# Altium schematic sheet MCU Power Clock Debug.SchDoc
size A4; Organization: TESLA Motors, INC; Address1: 3500 Deer Creek Road; Address2: Palo Alto, CA; Address4: U.S.A.; SheetNumber: 3; SheetTotal: 21
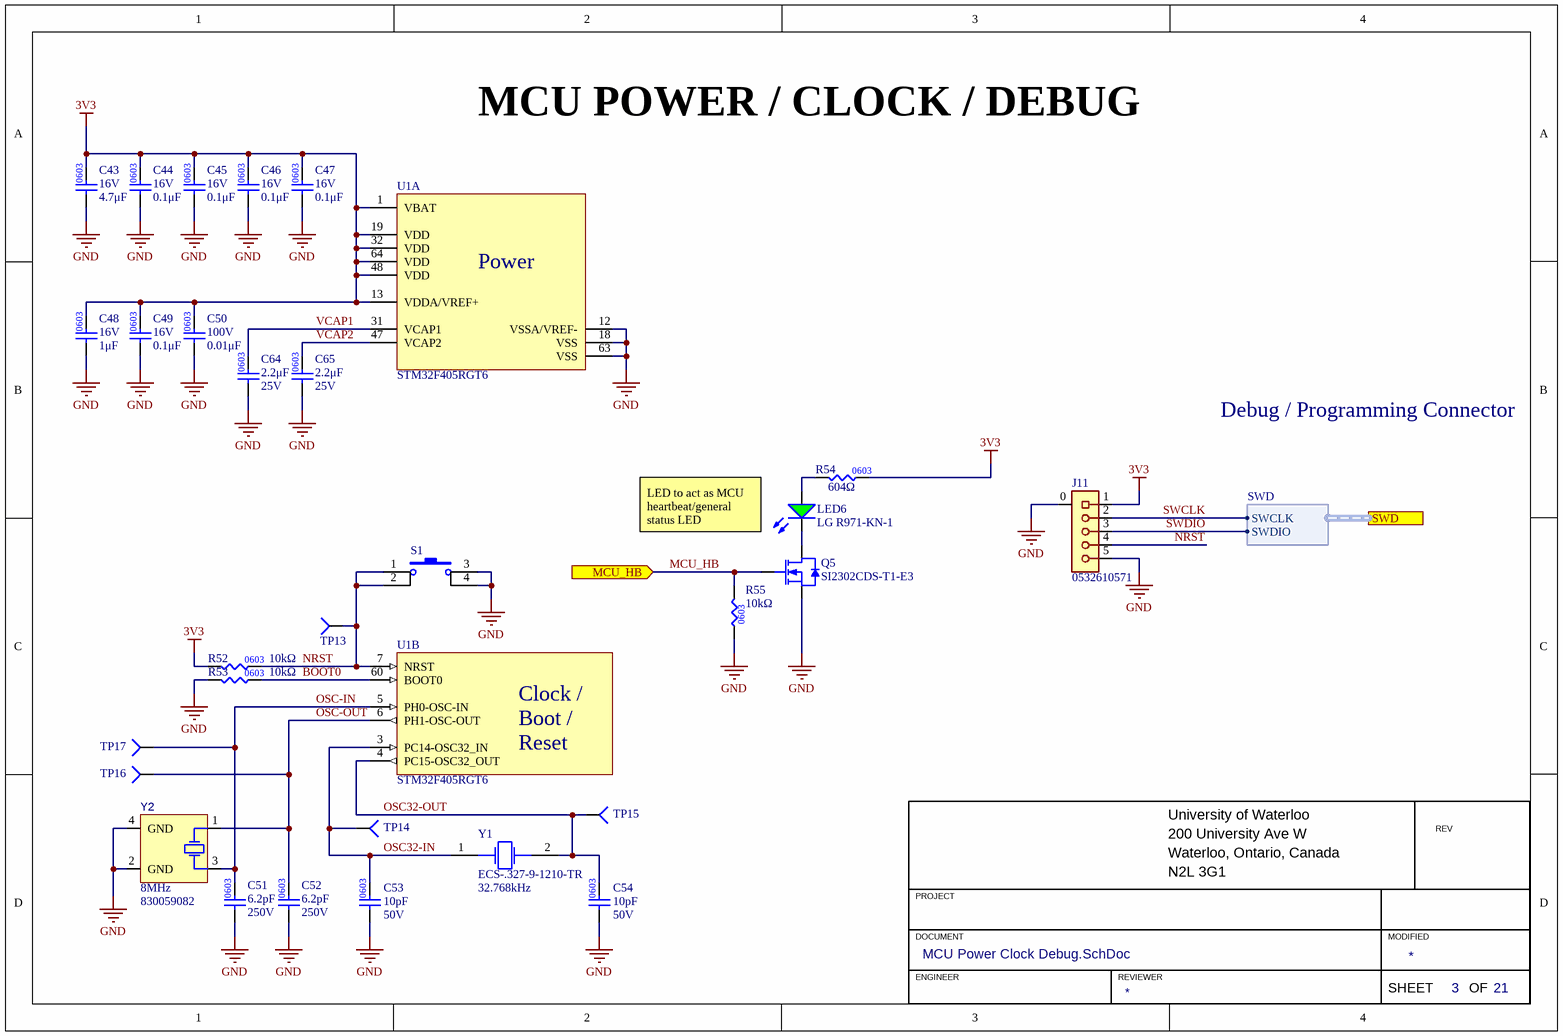
[diagram p0: MCU Power Clock Debug.SchDoc]

## Parts
C43  value 4.7μF  Voltage Rating: 16V  [CAP0603]  (hidden comment: CAP_4.7uF_16V_0603)
C44  value 0.1μF  Voltage Rating: 16V  [CAP0603]  (hidden comment: CAP_0.1uF_16V_0603)
C45  value 0.1μF  Voltage Rating: 16V  [CAP0603]  (hidden comment: CAP_0.1uF_16V_0603)
C46  value 0.1μF  Voltage Rating: 16V  [CAP0603]  (hidden comment: CAP_0.1uF_16V_0603)
C47  value 0.1μF  Voltage Rating: 16V  [CAP0603]  (hidden comment: CAP_0.1uF_16V_0603)
C48  value 1μF  Voltage Rating: 16V  [CAP0603]  (hidden comment: CAP_1uF_16V_0603)
C49  value 0.1μF  Voltage Rating: 16V  [CAP0603]  (hidden comment: CAP_0.1uF_16V_0603)
C50  value 0.01μF  Voltage Rating: 100V  [CAP0603]  (hidden comment: CAP_0.01uF_100V_0603)
C51  value 6.2pF  Voltage Rating: 250V  [CAP0603]  (hidden comment: CAP_6.2pF_250V_0603)
C52  value 6.2pF  Voltage Rating: 250V  [CAP0603]  (hidden comment: CAP_6.2pF_250V_0603)
C53  value 10pF  Voltage Rating: 50V  [CAP0603]  (hidden comment: CAP_10pF_50V_0603)
C54  value 10pF  Voltage Rating: 50V  [CAP0603]  (hidden comment: CAP_10pF_50V_0603)
C64  value 2.2μF  Voltage Rating: 25V  [CAP0603]  (hidden comment: CAP_2.2uF_25V_0603)
C65  value 2.2μF  Voltage Rating: 25V  [CAP0603]  (hidden comment: CAP_2.2uF_25V_0603)
J11  Manufacturer Part Number 1: 0532610571  [MOLEX-532610571]  (hidden comment: CON_MOLEX-PICO_5POS_RA)
LED6  Manufacturer Part Number 1: LG R971-KN-1  [LED_0805_GREEN]  (hidden comment: LED_GREEN)
Q5  Manufacturer Part Number 1: SI2302CDS-T1-E3  [SOT23-3]  (hidden comment: NMOS_20V_6A)
R52  value 10kΩ  [RES0603]  (hidden comment: RES_10kΩ_0603_1%)
R53  value 10kΩ  [RES0603]  (hidden comment: RES_10kΩ_0603_1%)
R54  value 604Ω  [RES0603]  (hidden comment: RES_604Ω_0603_1%)
R55  value 10kΩ  [RES0603]  (hidden comment: RES_10kΩ_0603_1%)
S1  SW_SPST_NO_4.5x4.5  [SPST_PUSHBUTTON_TL3305AF260QG]  (value not drawn)
TP13  TESTPOINT_1MM_CIRCLE  [TESTPOINT_CIRCLE_1MM]  (value not drawn)  (no BOM)
TP14  TESTPOINT_1MM_CIRCLE  [TESTPOINT_CIRCLE_1MM]  (value not drawn)  (no BOM)
TP15  TESTPOINT_1MM_CIRCLE  [TESTPOINT_CIRCLE_1MM]  (value not drawn)  (no BOM)
TP16  TESTPOINT_1MM_CIRCLE  [TESTPOINT_CIRCLE_1MM]  (value not drawn)  (no BOM)
TP17  TESTPOINT_1MM_CIRCLE  [TESTPOINT_CIRCLE_1MM]  (value not drawn)  (no BOM)
U1  STM32F405RGT6  [STM_LQFP64]  (parts A,B of 5)
Y1  Frequency: 32.768kHz  Manufacturer Part Number 1: ECS-.327-9-1210-TR  [OSC_ECS-327TR-2]  (hidden comment: CRYSTAL_32.768KHZ)
Y2  Frequency: 8MHz  Manufacturer Part Number 1: 830059082  [XTAL_WURTH_830059082]  (hidden comment: CRYSTAL_8MHZ_8PF)

## Ports
MCU_HB (in), SWD (harness SWD)

## Harnesses
SWD: SWDIO, SWCLK

## Nets
3V3: C43.2 C44.2 C45.2 C46.2 C47.2 C48.2 C49.2 C50.2 J11.1 R52.1 R54.2 U1.1(VBAT) U1.13(VDDA/VREF+) U1.19(VDD) U1.32(VDD) U1.48(VDD) U1.64(VDD)
GND: C43.1 C44.1 C45.1 C46.1 C47.1 C48.1 C49.1 C50.1 C51.1 C52.1 C53.1 C54.1 C64.1 C65.1 J11.0 J11.5 Q5.2(SOURCE) R53.1 R55.1 S1.3 S1.4 U1.12(VSSA/VREF-) U1.18(VSS) U1.63(VSS) Y2.2(GND) Y2.4(GND)
BOOT0: R53.2 U1.60(BOOT0)
MCU_HB: Q5.1(GATE) R55.2 ; port MCU_HB
NRST: J11.4 R52.2 S1.1 S1.2 TP13.1(=value) U1.7(NRST)
OSC32-IN: C53.2 TP14.1(=value) U1.3(PC14-OSC32_IN) Y1.1
OSC32-OUT: C54.2 TP15.1(=value) U1.4(PC15-OSC32_OUT) Y1.2
OSC-IN: C51.2 TP17.1(=value) U1.5(PH0-OSC-IN) Y2.3(HOT)
OSC-OUT: C52.2 TP16.1(=value) U1.6(PH1-OSC-OUT) Y2.1(HOT)
SWCLK: J11.2 ; port SWD.SWCLK
SWDIO: J11.3 ; port SWD.SWDIO
VCAP1: C64.2 U1.31(VCAP1)
VCAP2: C65.2 U1.47(VCAP2)
NetLED6_1: LED6.1(A) R54.1
NetLED6_2: LED6.2(K) Q5.3(DRAIN)

## Notes on the sheet
- MCU POWER / CLOCK / DEBUG
- Debug / Programming Connector
- LED to act as MCU heartbeat/general status LED
- University of Waterloo
- 200 University Ave W
- REV
- PROJECT
- Waterloo, Ontario, Canada
- N2L 3G1
- DOCUMENT
- ENGINEER
- REVIEWER
- MODIFIED
- SHEET
- OF
- (in symbol CAP_0.01uF_100V_0603) 0603
- (in symbol CAP_2.2uF_25V_0603) 0603
- (in symbol RES_604Ω_0603_1%) 0603
- (in symbol STM32F405RGT6, part A) Power
- (in symbol STM32F405RGT6, part B) Clock / / Boot / / Reset

## Library data of the parts
C43 = CAP_4.7uF_16V_0603: CAP CER 4.7UF 16V X6S 0603; Manufacturer Part Number 1: GRM188C81C475KE11D; Manufacturer 1: Murata Electronics; Supplier Part Number 1: 490-13362-1-ND; Supplier 1: Digi-Key; Mounting Type: SMD; Package: 0603; Dielectric: X6S
C44-C47 C49 = CAP_0.1uF_16V_0603: CAP CER 0.1UF 16V X7R 0603; Manufacturer Part Number 1: CC0603KRX7R7BB104; Manufacturer 1: Yageo; Package: 0603; Supplier Part Number 1: 311-1088-1-ND; Supplier 1: Digi-Key; Dielectric: X7R
C48 = CAP_1uF_16V_0603: CAP CER 1UF 16V X7R 0603; Manufacturer 1: Yageo; Manufacturer Part Number 1: CC0603KPX7R7BB105; Supplier Part Number 1: 13-CC0603KPX7R7BB105CT-ND; Supplier 1: Digi-Key; Mounting Type: SMD; Package: 0603; Dielectric: X7R
C50 = CAP_0.01uF_100V_0603: CAP CER 0.01uF 100V X7R 0603; Manufacturer Part Number 1: GCM188R72A103KA37J; Manufacturer 1: Murata Electronics; Supplier Part Number 1: 490-8028-1-ND; Supplier 1: Digi-Key; Dielectric: X7R
C51 C52 = CAP_6.2pF_250V_0603: HVCAP0603 COG 6.2PF .25PF 250V; Manufacturer Part Number 1: CHV0603N2506R2CCT; Manufacturer 1: Cal-Chip Electronics, Inc.; Dielectric: C0G, NP0; Supplier Part Number 1: 4713-CHV0603N2506R2CCT-ND; Supplier 1: Digi-Key; Mounting Type: SMD; Package: 0603
C53 C54 = CAP_10pF_50V_0603: CAP CER 10PF 50V X7R 0603; Manufacturer 1: KEMET; Manufacturer Part Number 1: C0603C100J5RAC7867; Package: 0603; Supplier 1: Digi-Key; Supplier Part Number 1: 399-C0603C100J5RAC7867CT-ND
C64 C65 = CAP_2.2uF_25V_0603: CAP CER 2.2UF 25V X5R 0603; Manufacturer Part Number 1: C1608X5R1E225K080AB; Manufacturer 1: TDK Corporation; Dielectric: 5; Supplier Part Number 1: 445-5964-1-ND; Supplier 1: Digi-Key
J11 = CON_MOLEX-PICO_5POS_RA: CONN HEADER SMD R/A 5POS 1.25MM; Manufacturer 1: Molex; Supplier 1: Digi-Key; Supplier Part Number 1: WM7623CT-ND
LED6 = LED_GREEN: LED GREEN DIFFUSED 0805 SMD; Manufacturer 1: OSRAM; Forward Voltage Drop: 2.2V; Package/Footprint: 0805; Supplier Part Number 1: 475-1410-1-ND; Supplier 1: Digi-Key; Mounting Type: SMD
Q5 = NMOS_20V_2.6A: MOSFET N-CH 20V 2.6A SOT23-3; Manufacturer 1: Vishay Siliconix; Package/Footprint: SOT-23-3; Supplier 1: Digi-Key; Supplier Part Number 1: SI2302CDS-T1-E3CT-ND
R52 R53 R55 = RES_10kΩ_0603_1%: RES 10K OHM 1% 1/8W 0603; Manufacturer 1: Stackpole Electronics Inc; Manufacturer Part Number 1: RNCP0603FTD10K0; Supplier Part Number 1: RNCP0603FTD10K0CT-ND; Supplier 1: Digi-Key; Mounting Type: SMD; Package: 0603
R54 = RES_604Ω_0603_1%: RES 604 OHM 1% 1/10W 0603; Manufacturer 1: Yageo; Manufacturer Part Number 1: RC0603FR-07604RL; Supplier Part Number 1: 311-604HRCT-ND; Supplier 1: Digi-Key
S1 = SW_SPST_NO_4.5x4.5: SWITCH TACTILE SPST-NO 50MA 12V; Manufacturer Part Number 1: TL3305AF260QG; Manufacturer 1: E-Switch; Mounting Type: SMD; Supplier 1: Digi-Key; Supplier Part Number 1: EG5353CT-ND
TP13-TP17 = TESTPOINT_1MM_CIRCLE: TESTPOINT 1MM CIRCLE
U1 = STM32F405RGT6: IC MCU 32BIT 1MB FLASH 64LQFP; Manufacturer 1: STMicroelectronics; Package/Footprint: 64-LQFP; Manufacturer Part Number 1: STM32F405RGT6; Supplier 1: Digi-Key; Supplier Part Number 1: 497-11767-ND
Y1 = CRYSTAL_32.768KHZ: CRYSTAL 32.7680KHZ 9PF SMD; Manufacturer 1: ECS Inc.; Supplier 1: Digi-Key; Supplier Part Number 1: XC2283CT-ND
Y2 = CRYSTAL_8MHZ_8PF: WE-XTAL QUARTZ CRYSTAL 8.0 MHZ;; Manufacturer 1: Kyocera AVX; Package/Footprint: SMD; Load Capacitance: 10pF; Mounting Type: SMD; Supplier 1: Digikey; Supplier Part Number 1: 1923-830059082CT-ND